# EAGLE schematic board (EAGLE 6.1)
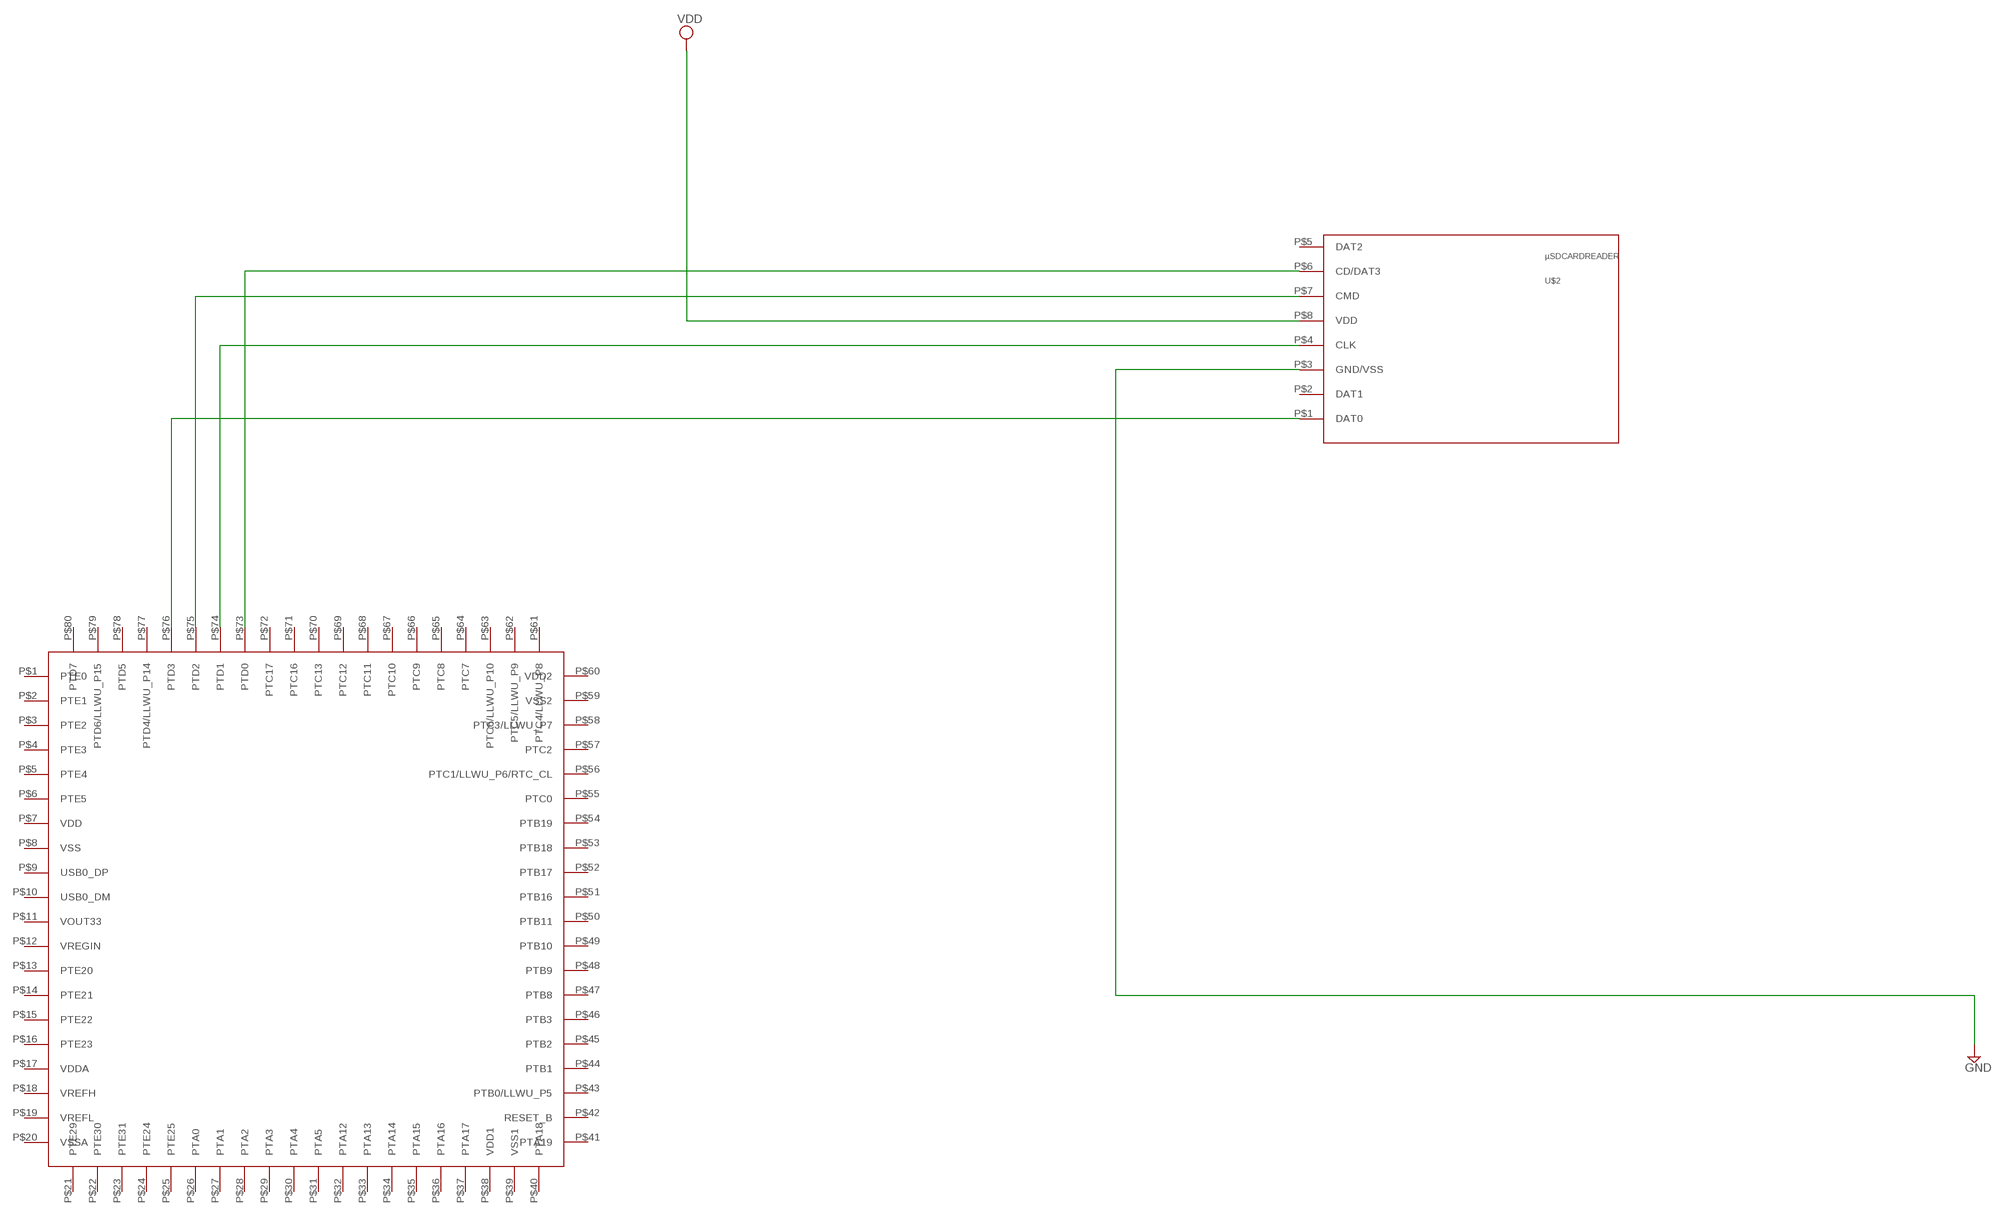
[diagram p0: schematic, sheet 1]

## Parts
U$1  KL25Z_LQFP80  [KL25Z_LQFP80]
U$2  µSDCARDREADER  [MICROSD]

## Nets
GND: U$2.P$3(GND/VSS)
N$1: U$1.P$76(PTD3) U$2.P$1(DAT0)
N$2: U$1.P$75(PTD2) U$2.P$7(CMD)
N$3: U$1.P$73(PTD0) U$2.P$6(CD/DAT3)
N$4: U$1.P$74(PTD1) U$2.P$4(CLK)
VDD: U$2.P$8(VDD)
Unconnected: U$1.P$1(PTE0) U$1.P$2(PTE1) U$1.P$3(PTE2) U$1.P$4(PTE3) U$1.P$5(PTE4) U$1.P$6(PTE5) U$1.P$7(VDD) U$1.P$8(VSS) U$1.P$9(USB0_DP) U$1.P$10(USB0_DM) U$1.P$11(VOUT33) U$1.P$12(VREGIN) U$1.P$13(PTE20) U$1.P$14(PTE21) U$1.P$15(PTE22) U$1.P$16(PTE23) U$1.P$17(VDDA) U$1.P$18(VREFH) U$1.P$19(VREFL) U$1.P$20(VSSA) U$1.P$21(PTE29) U$1.P$22(PTE30) U$1.P$23(PTE31) U$1.P$24(PTE24) U$1.P$25(PTE25) U$1.P$26(PTA0) U$1.P$27(PTA1) U$1.P$28(PTA2) U$1.P$29(PTA3) U$1.P$30(PTA4) U$1.P$31(PTA5) U$1.P$32(PTA12) U$1.P$33(PTA13) U$1.P$34(PTA14) U$1.P$35(PTA15) U$1.P$36(PTA16) U$1.P$37(PTA17) U$1.P$38(VDD1) U$1.P$39(VSS1) U$1.P$40(PTA18) U$1.P$41(PTA19) U$1.P$42(RESET_B) U$1.P$43(PTB0/LLWU_P5) U$1.P$44(PTB1) U$1.P$45(PTB2) U$1.P$46(PTB3) U$1.P$47(PTB8) U$1.P$48(PTB9) U$1.P$49(PTB10) U$1.P$50(PTB11) U$1.P$51(PTB16) U$1.P$52(PTB17) U$1.P$53(PTB18) U$1.P$54(PTB19) U$1.P$55(PTC0) U$1.P$56(PTC1/LLWU_P6/RTC_CL) U$1.P$57(PTC2) U$1.P$58(PTC3/LLWU_P7) U$1.P$59(VSS2) U$1.P$60(VDD2) U$1.P$61(PTC4/LLWU_P8) U$1.P$62(PTC5/LLWU_P9) U$1.P$63(PTC6/LLWU_P10) U$1.P$64(PTC7) U$1.P$65(PTC8) U$1.P$66(PTC9) U$1.P$67(PTC10) U$1.P$68(PTC11) U$1.P$69(PTC12) U$1.P$70(PTC13) U$1.P$71(PTC16) U$1.P$72(PTC17) U$1.P$77(PTD4/LLWU_P14) U$1.P$78(PTD5) U$1.P$79(PTD6/LLWU_P15) U$1.P$80(PTD7) U$2.P$2(DAT1) U$2.P$5(DAT2)

## Library data of the parts
U$1 = KL25Z_LQFP80:KL25Z_LQFP80: Freescale MCU 48MHz LQFP80
U$2 = Microsd:µSDCARDREADER